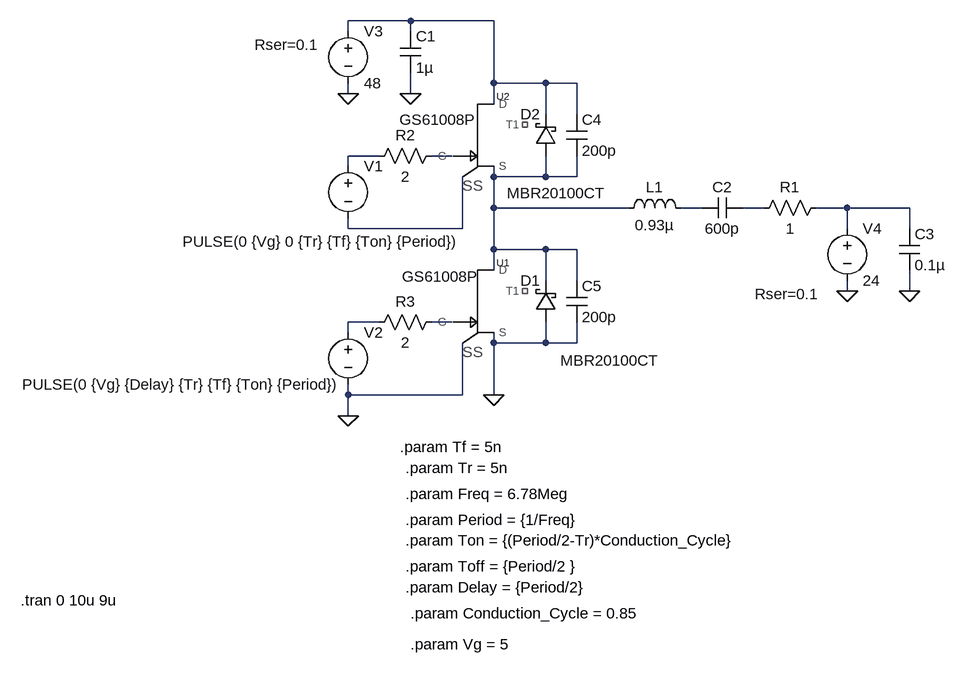
[diagram p0: schematic class_DE_simple.asc]
class_DE_simple.asc, the LTspice schematic file:
Version 4
SHEET 1 880 736
WIRE 16 -240 -80 -240
WIRE 144 -240 16 -240
WIRE -80 -224 -80 -240
WIRE 16 -224 16 -240
WIRE 144 -144 144 -240
WIRE 224 -144 144 -144
WIRE 272 -144 224 -144
WIRE -80 -128 -80 -144
WIRE 16 -128 16 -160
WIRE 144 -112 144 -144
WIRE 224 -96 224 -144
WIRE 272 -96 272 -144
WIRE -32 -32 -80 -32
WIRE 80 -32 48 -32
WIRE -80 -16 -80 -32
WIRE 144 0 144 -16
WIRE 224 0 224 -32
WIRE 224 0 144 0
WIRE 272 0 272 -32
WIRE 272 0 224 0
WIRE 144 48 144 0
WIRE 352 48 144 48
WIRE 464 48 432 48
WIRE 560 48 528 48
WIRE 688 48 640 48
WIRE 784 48 688 48
WIRE -80 80 -80 64
WIRE 96 80 96 0
WIRE 96 80 -80 80
WIRE 688 80 688 48
WIRE 784 80 784 48
WIRE 144 112 144 48
WIRE 224 112 144 112
WIRE 272 112 224 112
WIRE 144 144 144 112
WIRE 224 160 224 112
WIRE 272 160 272 112
WIRE 688 176 688 160
WIRE 784 176 784 144
WIRE -32 224 -80 224
WIRE 80 224 48 224
WIRE -80 240 -80 224
WIRE 144 256 144 240
WIRE 224 256 224 224
WIRE 224 256 144 256
WIRE 272 256 272 224
WIRE 272 256 224 256
WIRE -80 336 -80 320
WIRE 96 336 96 256
WIRE 96 336 -80 336
WIRE 144 336 144 256
WIRE -80 368 -80 336
FLAG 688 176 0
FLAG 144 336 0
FLAG -80 368 0
FLAG -80 -128 0
FLAG 16 -128 0
FLAG 784 176 0
SYMBOL GaN_E-HEMT_LT_GS61008P 96 192 R0
WINDOW 3 -34 -38 Center 2
SYMATTR InstName U1
SYMBOL GaN_E-HEMT_LT_GS61008P 96 -64 R0
WINDOW 3 -38 -24 Center 2
SYMATTR InstName U2
SYMBOL voltage -80 -32 R0
WINDOW 3 -255 132 Left 2
WINDOW 123 0 0 Left 2
WINDOW 39 0 0 Left 2
SYMATTR InstName V1
SYMATTR Value PULSE(0 {Vg} 0 {Tr} {Tf} {Ton} {Period})
SYMBOL voltage -80 224 R0
WINDOW 3 -502 96 Left 2
WINDOW 123 0 0 Left 2
WINDOW 39 0 0 Left 2
SYMATTR InstName V2
SYMATTR Value PULSE(0 {Vg} {Delay} {Tr} {Tf} {Ton} {Period})
SYMBOL voltage -80 -240 R0
WINDOW 123 0 0 Left 2
WINDOW 39 -144 37 Left 2
SYMATTR InstName V3
SYMATTR Value 48
SYMATTR SpiceLine Rser=0.1
SYMBOL cap 0 -224 R0
SYMATTR InstName C1
SYMATTR Value 1µ
SYMBOL ind 336 64 R270
WINDOW 0 32 56 VTop 2
WINDOW 3 5 56 VBottom 2
SYMATTR InstName L1
SYMATTR Value 0.93µ
SYMBOL cap 528 32 R90
WINDOW 0 0 32 VBottom 2
WINDOW 3 32 32 VTop 2
SYMATTR InstName C2
SYMATTR Value 600p
SYMBOL res 656 32 R90
WINDOW 0 0 56 VBottom 2
WINDOW 3 32 56 VTop 2
SYMATTR InstName R1
SYMATTR Value 1
SYMBOL voltage 688 64 R0
WINDOW 123 0 0 Left 2
WINDOW 39 -142 117 Left 2
SYMATTR InstName V4
SYMATTR Value 24
SYMATTR SpiceLine Rser=0.1
SYMBOL res -48 -16 R270
WINDOW 0 32 56 VTop 2
WINDOW 3 0 56 VBottom 2
SYMATTR InstName R2
SYMATTR Value 2
SYMBOL res -48 240 R270
WINDOW 0 32 56 VTop 2
WINDOW 3 0 56 VBottom 2
SYMATTR InstName R3
SYMATTR Value 2
SYMBOL cap 768 80 R0
SYMATTR InstName C3
SYMATTR Value 0.1µ
SYMBOL cap 256 -96 R0
SYMATTR InstName C4
SYMATTR Value 200p
SYMBOL cap 256 160 R0
SYMATTR InstName C5
SYMATTR Value 200p
SYMBOL schottky 240 224 R180
WINDOW 0 24 64 Left 2
WINDOW 3 -160 -59 Left 2
SYMATTR InstName D1
SYMATTR Value MBR20100CT
SYMBOL schottky 240 -32 R180
WINDOW 0 24 64 Left 2
WINDOW 3 -77 -57 Left 2
SYMATTR InstName D2
SYMATTR Value MBR20100CT
TEXT 0 416 Left 2 !.param Tf = 5n
TEXT 8 448 Left 2 !.param Tr = 5n
TEXT 8 488 Left 2 !.param Freq = 6.78Meg
TEXT 8 528 Left 2 !.param Period = {1/Freq}
TEXT 8 560 Left 2 !.param Ton = {(Period/2-Tr)*Conduction_Cycle}
TEXT 8 600 Left 2 !.param Toff = {Period/2 }
TEXT 8 632 Left 2 !.param Delay = {Period/2}
TEXT -584 652 Left 2 !.tran 0 10u 9u
TEXT 16 672 Left 2 !.param Conduction_Cycle = 0.85
TEXT 16 720 Left 2 !.param Vg = 5

The netlist it stands for:
* class_DE_simple.asc
XU1 N010 N004 0 0 NC_01 GS61008P  ; pins G D S SS T1
XU2 N003 N001 N004 N008 NC_02 GS61008P  ; pins G D S SS T1
V1 N002 N008 PULSE(0 {Vg} 0 {Tr} {Tf} {Ton} {Period})
V2 N009 0 PULSE(0 {Vg} {Delay} {Tr} {Tf} {Ton} {Period})
V3 N001 0 48 Rser=0.1
C1 N001 0 1µ
L1 N004 N005 0.93µ
C2 N006 N005 600p
R1 N007 N006 1
V4 N007 0 24 Rser=0.1
R2 N002 N003 2
R3 N009 N010 2
C3 N007 0 0.1µ
C4 N001 N004 200p
C5 N004 0 200p
D1 0 N004 MBR20100CT
D2 N004 N001 MBR20100CT
.model D D
.lib standard.dio
.param Tf = 5n
.param Tr = 5n
.param Freq = 6.78Meg
.param Period = {1/Freq}
.param Ton = {(Period/2-Tr)*Conduction_Cycle}
.param Toff = {Period/2 }
.param Delay = {Period/2}
.tran 0 10u 9u
.param Conduction_Cycle = 0.85
.param Vg = 5
.lib GaN_LTspice_GS61008P_Release1p27.lib
.backanno
.end